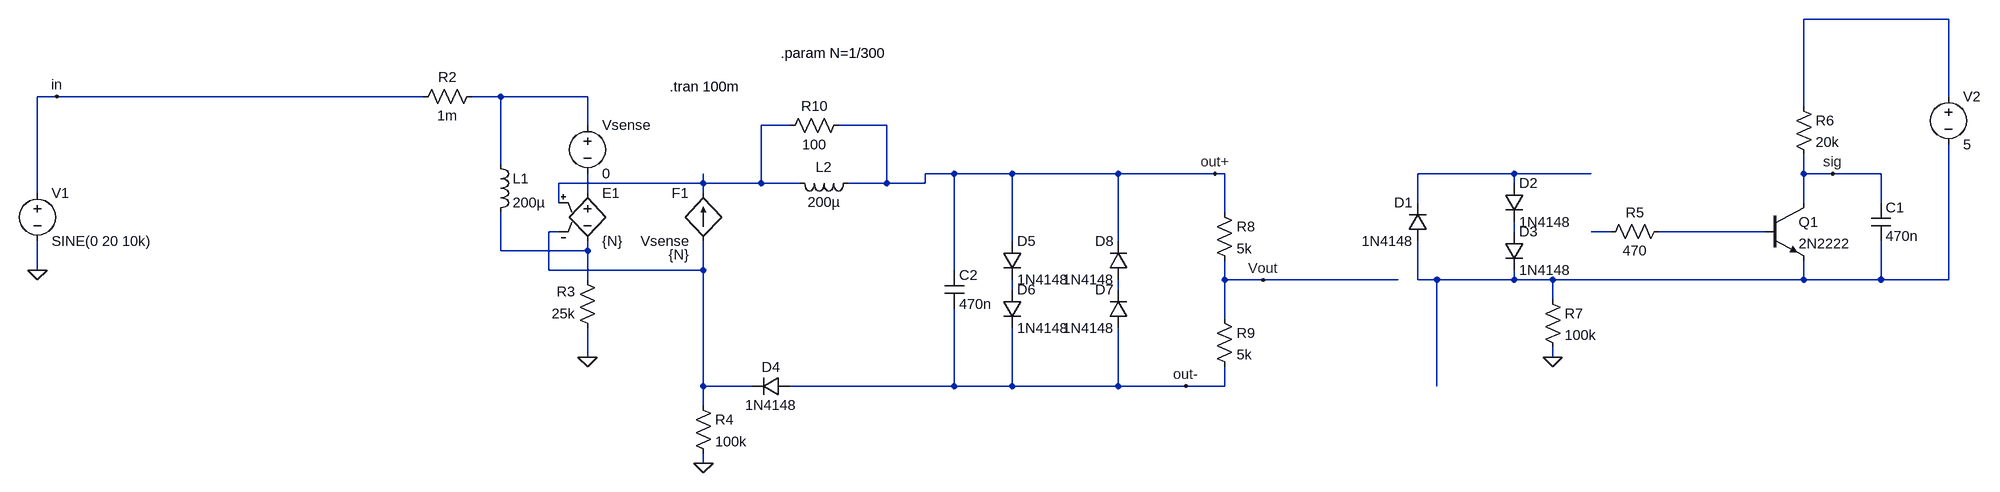
[diagram p0: schematic CurrentSense_Mustangpeak.asc]
CurrentSense_Mustangpeak.asc, the LTspice schematic file:
Version 4
SHEET 1 2460 768
WIRE 2400 -32 2160 -32
WIRE -736 96 -768 96
WIRE -128 96 -736 96
WIRE 0 96 -48 96
WIRE 144 96 0 96
WIRE 2400 96 2400 -32
WIRE 2160 112 2160 -32
WIRE 144 144 144 96
WIRE 480 144 432 144
WIRE 640 144 560 144
WIRE 0 208 0 96
WIRE 752 224 704 224
WIRE 848 224 752 224
WIRE 1024 224 848 224
WIRE 1184 224 1024 224
WIRE 1200 224 1184 224
WIRE 1680 224 1520 224
WIRE 1808 224 1680 224
WIRE 2160 224 2160 192
WIRE 2208 224 2160 224
WIRE 2288 224 2208 224
WIRE 336 240 336 224
WIRE 336 240 96 240
WIRE 432 240 432 144
WIRE 432 240 336 240
WIRE 496 240 432 240
WIRE 640 240 640 144
WIRE 640 240 576 240
WIRE 704 240 704 224
WIRE 704 240 640 240
WIRE 1680 240 1680 224
WIRE -768 256 -768 96
WIRE 144 256 144 224
WIRE 336 256 336 240
WIRE 96 272 96 240
WIRE 1520 272 1520 224
WIRE 2160 272 2160 224
WIRE 2288 272 2288 224
WIRE 1200 288 1200 224
WIRE 96 320 80 320
WIRE 1680 320 1680 304
WIRE 1840 320 1808 320
WIRE 2096 320 1920 320
WIRE 848 336 848 224
WIRE 1024 336 1024 224
WIRE 0 352 0 288
WIRE 144 352 144 336
WIRE 144 352 0 352
WIRE -768 384 -768 336
WIRE 80 384 80 320
WIRE 336 384 336 336
WIRE 336 384 80 384
WIRE 752 384 752 224
WIRE 144 400 144 352
WIRE 1200 400 1200 368
WIRE 1264 400 1200 400
WIRE 1488 400 1264 400
WIRE 1520 400 1520 336
WIRE 1552 400 1520 400
WIRE 1680 400 1680 384
WIRE 1680 400 1552 400
WIRE 1744 400 1680 400
WIRE 2160 400 2160 368
WIRE 2160 400 1744 400
WIRE 2288 400 2288 336
WIRE 2288 400 2160 400
WIRE 2400 400 2400 176
WIRE 2400 400 2288 400
WIRE 848 416 848 400
WIRE 1024 416 1024 400
WIRE 1744 432 1744 400
WIRE 1200 464 1200 400
WIRE 144 528 144 480
WIRE 1744 528 1744 512
WIRE 336 576 336 384
WIRE 416 576 336 576
WIRE 752 576 752 448
WIRE 752 576 480 576
WIRE 848 576 848 480
WIRE 848 576 752 576
WIRE 1024 576 1024 480
WIRE 1024 576 848 576
WIRE 1136 576 1024 576
WIRE 1200 576 1200 544
WIRE 1200 576 1136 576
WIRE 1552 576 1552 400
WIRE 336 608 336 576
WIRE 336 704 336 688
FLAG -768 384 0
FLAG 144 528 0
FLAG 336 704 0
FLAG 1184 224 out+
FLAG -736 96 in
FLAG 1136 576 out-
FLAG 2208 224 sig
FLAG 1744 528 0
FLAG 1264 400 Vout
SYMBOL e 144 240 R0
SYMATTR InstName E1
SYMATTR Value {N}
SYMBOL f 336 336 R180
WINDOW 0 24 80 Left 2
WINDOW 3 24 0 Left 2
WINDOW 123 24 -22 Left 2
SYMATTR InstName F1
SYMATTR Value Vsense
SYMATTR Value2 {N}
SYMBOL voltage 144 128 R0
SYMATTR InstName Vsense
SYMATTR Value 0
SYMBOL voltage -768 240 R0
SYMATTR InstName V1
SYMATTR Value SINE(0 20 10k)
SYMBOL Res -32 80 R90
WINDOW 0 0 56 VBottom 2
WINDOW 3 32 56 VTop 2
SYMATTR InstName R2
SYMATTR Value 1m
SYMBOL Res 160 496 R180
WINDOW 0 36 76 Left 2
WINDOW 3 36 40 Left 2
SYMATTR InstName R3
SYMATTR Value 25k
SYMBOL Res 320 592 R0
SYMATTR InstName R4
SYMATTR Value 100k
SYMBOL diode 1536 336 R180
WINDOW 0 24 64 Left 2
WINDOW 3 24 0 Left 2
SYMATTR InstName D1
SYMATTR Value 1N4148
SYMBOL diode 1664 240 R0
SYMATTR InstName D2
SYMATTR Value 1N4148
SYMBOL diode 1664 320 R0
SYMATTR InstName D3
SYMATTR Value 1N4148
SYMBOL npn 2096 272 R0
SYMATTR InstName Q1
SYMATTR Value 2N2222
SYMBOL cap 2272 272 R0
SYMATTR InstName C1
SYMATTR Value 470n
SYMBOL Res 1936 304 R90
WINDOW 0 0 56 VBottom 2
WINDOW 3 32 56 VTop 2
SYMATTR InstName R5
SYMATTR Value 470
SYMBOL voltage 2400 80 R0
SYMATTR InstName V2
SYMATTR Value 5
SYMBOL Res 2144 96 R0
SYMATTR InstName R6
SYMATTR Value 20k
SYMBOL ind -16 192 R0
SYMATTR InstName L1
SYMATTR Value 200µ
SYMBOL Res 1728 416 R0
SYMATTR InstName R7
SYMATTR Value 100k
SYMBOL Res 1184 272 R0
SYMATTR InstName R8
SYMATTR Value 5k
SYMBOL Res 1184 448 R0
SYMATTR InstName R9
SYMATTR Value 5k
SYMBOL diode 480 560 R90
WINDOW 0 0 32 VBottom 2
WINDOW 3 32 32 VTop 2
SYMATTR InstName D4
SYMATTR Value 1N4148
SYMBOL cap 736 384 R0
SYMATTR InstName C2
SYMATTR Value 470n
SYMBOL ind 592 224 R90
WINDOW 0 5 56 VBottom 2
WINDOW 3 32 56 VTop 2
SYMATTR InstName L2
SYMATTR Value 200µ
SYMBOL Res 576 128 R90
WINDOW 0 0 56 VBottom 2
WINDOW 3 32 56 VTop 2
SYMATTR InstName R10
SYMATTR Value 100
SYMBOL diode 832 336 R0
SYMATTR InstName D5
SYMATTR Value 1N4148
SYMBOL diode 832 416 R0
SYMATTR InstName D6
SYMATTR Value 1N4148
SYMBOL diode 1040 480 R180
WINDOW 0 24 64 Left 2
WINDOW 3 24 0 Left 2
SYMATTR InstName D7
SYMATTR Value 1N4148
SYMBOL diode 1040 400 R180
WINDOW 0 24 64 Left 2
WINDOW 3 24 0 Left 2
SYMATTR InstName D8
SYMATTR Value 1N4148
TEXT 280 80 Left 2 !.tran 100m
TEXT 464 24 Left 2 !.param N=1/300

The netlist it stands for:
* CurrentSense_Mustangpeak.asc
E1 N005 N010 N003 N006 {N}
F1 N006 N003 Vsense {N}
Vsense N002 N005 0
V1 in 0 SINE(0 20 10k)
R2 N002 in 1m
R3 0 N010 25k
R4 N006 0 100k
D1 N011 N004 1N4148
D2 N004 N007 1N4148
D3 N007 N011 1N4148
Q1 sig N009 N011 0 2N2222
C1 sig N011 470n
R5 N009 N008 470
V2 N001 N011 5
R6 N001 sig 20k
L1 N002 N010 200µ
R7 N011 0 100k
R8 out+ Vout 5k
R9 Vout out- 5k
D4 out- N006 1N4148
C2 out+ out- 470n
L2 out+ N003 200µ
R10 out+ N003 100
D5 out+ N012 1N4148
D6 N012 out- 1N4148
D7 out- N013 1N4148
D8 N013 out+ 1N4148
.model D D
.lib standard.dio
.model NPN NPN
.model PNP PNP
.lib standard.bjt
.tran 100m
.param N=1/300
.backanno
.end